# EAGLE schematic darlingtonDrivers (EAGLE 7.5.0)
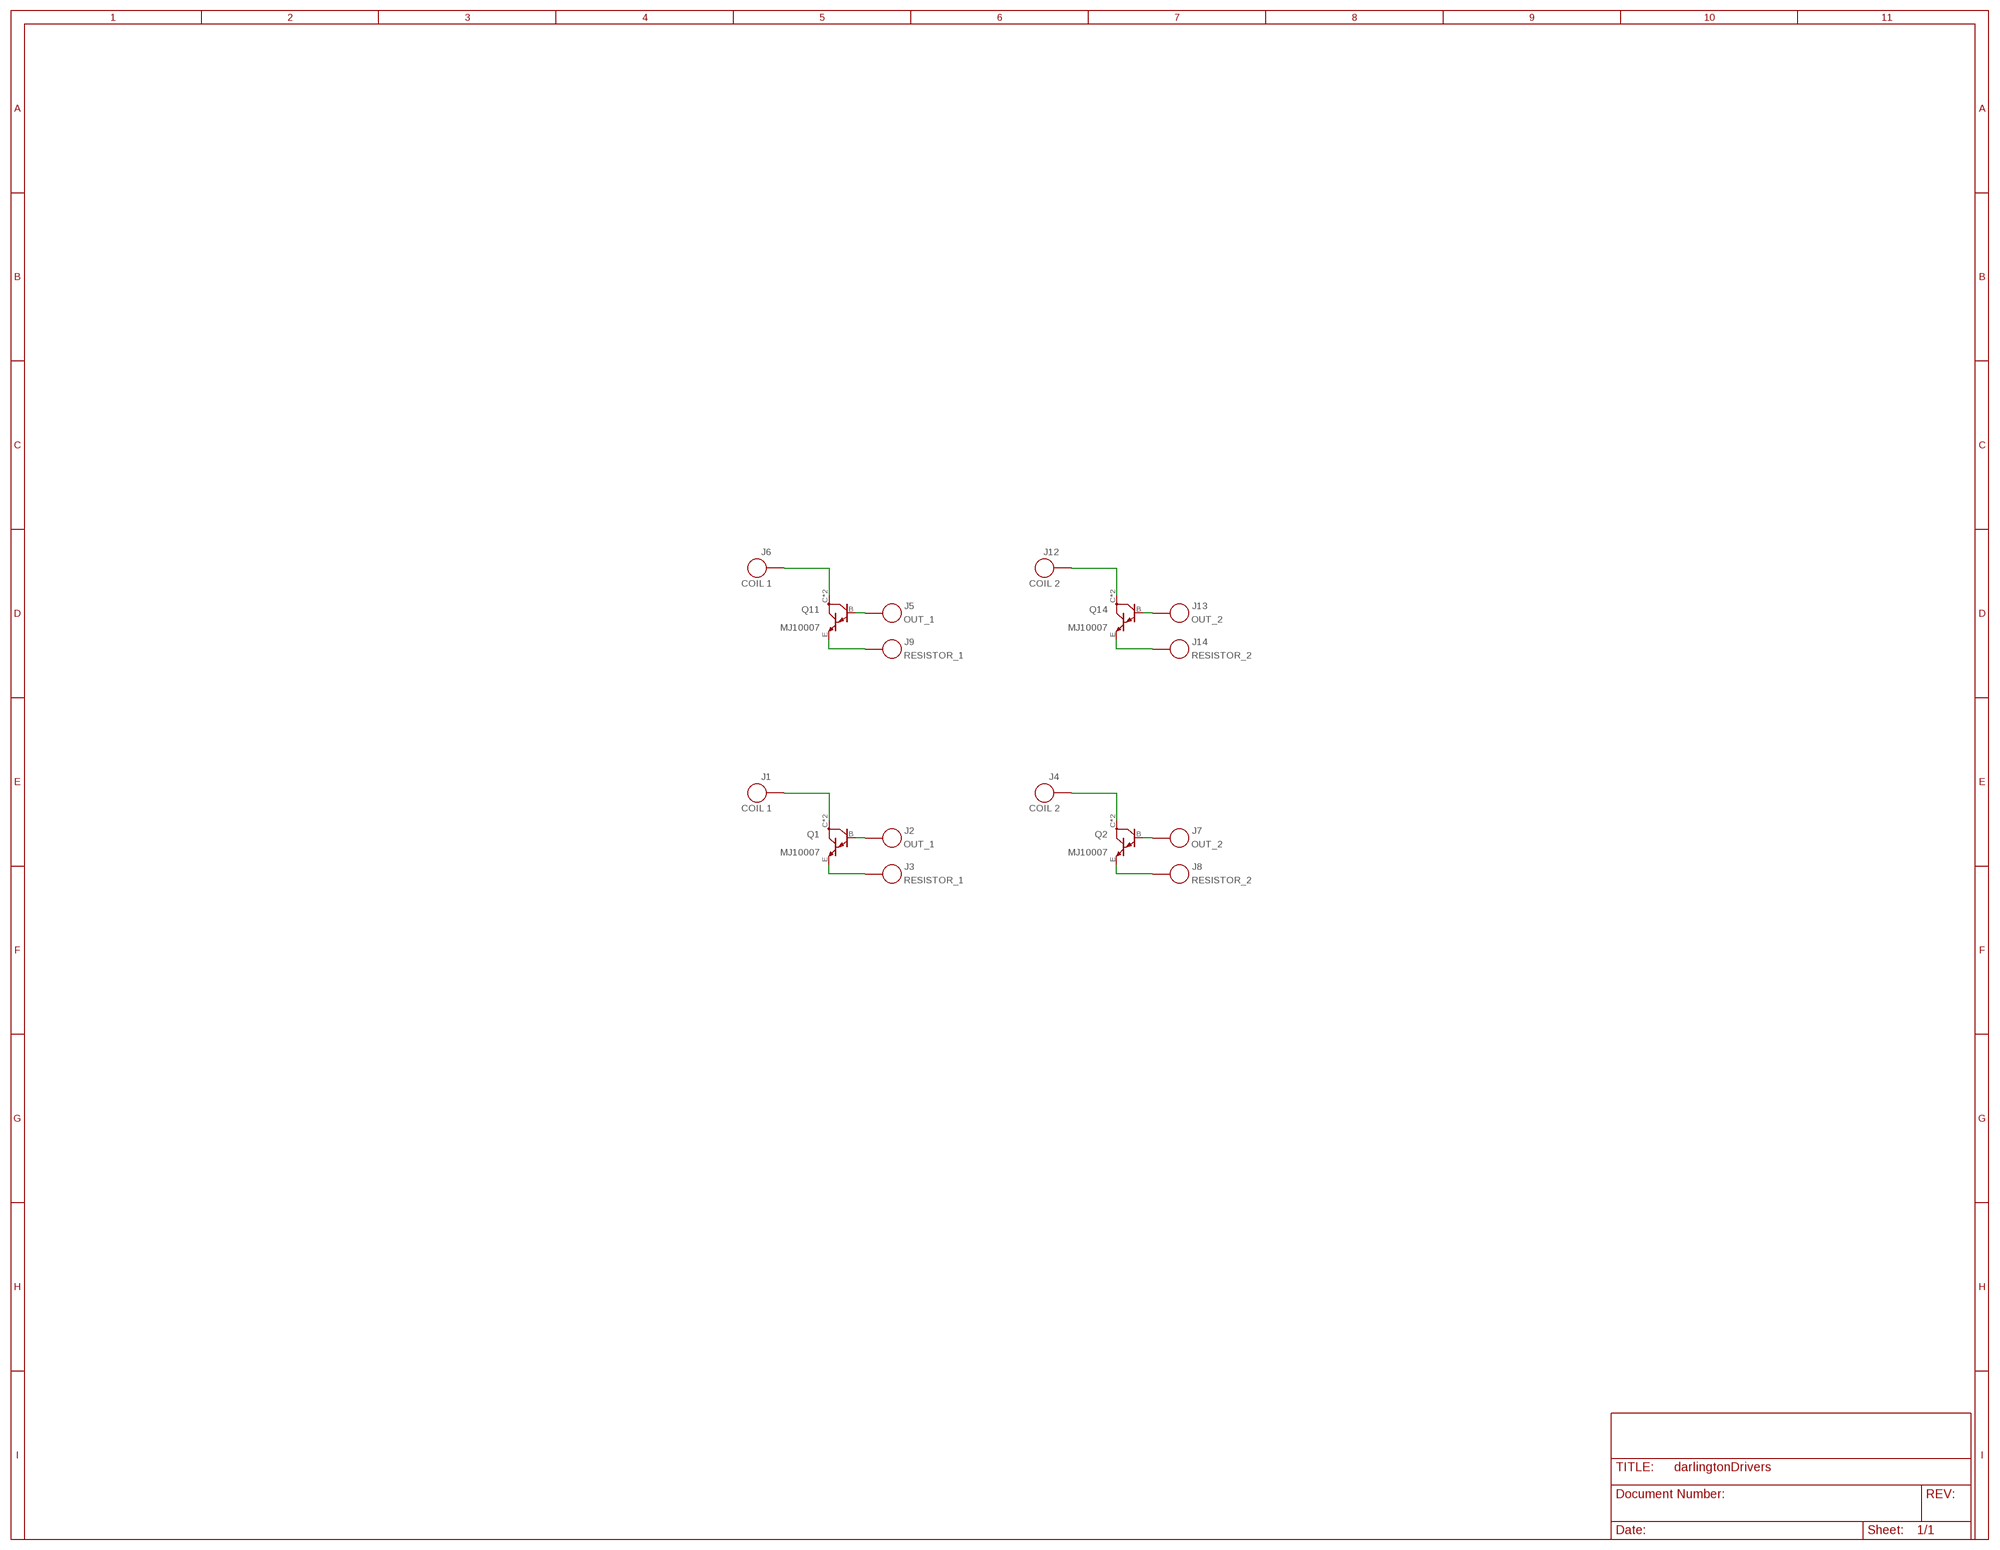
[diagram p0: schematic, sheet 1]

## Parts
J1  COIL 1  AWG18  [AWG18]
J2  OUT_1  AWG18  [AWG18]
J3  RESISTOR_1  AWG18  [AWG18]
J4  COIL 2  AWG18  [AWG18]
J5  OUT_1  AWG18  [AWG18]
J6  COIL 1  AWG18  [AWG18]
J7  OUT_2  AWG18  [AWG18]
J8  RESISTOR_2  AWG18  [AWG18]
J9  RESISTOR_1  AWG18  [AWG18]
J12  COIL 2  AWG18  [AWG18]
J13  OUT_2  AWG18  [AWG18]
J14  RESISTOR_2  AWG18  [AWG18]
Q1  MJ10007  [TO3]
Q2  MJ10007  [TO3]
Q11  MJ10007  [TO3]
Q14  MJ10007  [TO3]

## Nets
N$1: J1.P$1 Q1.C Q1.C/(C)
N$2: J2.P$1 Q1.B
N$3: J3.P$1 Q1.E
N$4: J4.P$1 Q2.C Q2.C/(C)
N$5: J7.P$1 Q2.B
N$6: J8.P$1 Q2.E
N$24: J5.P$1 Q11.B
N$26: J6.P$1 Q11.C Q11.C/(C)
N$28: J9.P$1 Q11.E
N$32: J12.P$1 Q14.C Q14.C/(C)
N$41: J13.P$1 Q14.B
N$42: J14.P$1 Q14.E

## Library data of the parts
J1-J9 J12-J14 = keiths:AWG18: AWG18 Wire Hole
Q1 Q2 Q11 Q14 = keiths:MJ10007: NPN Darlington; PN: MJ10007